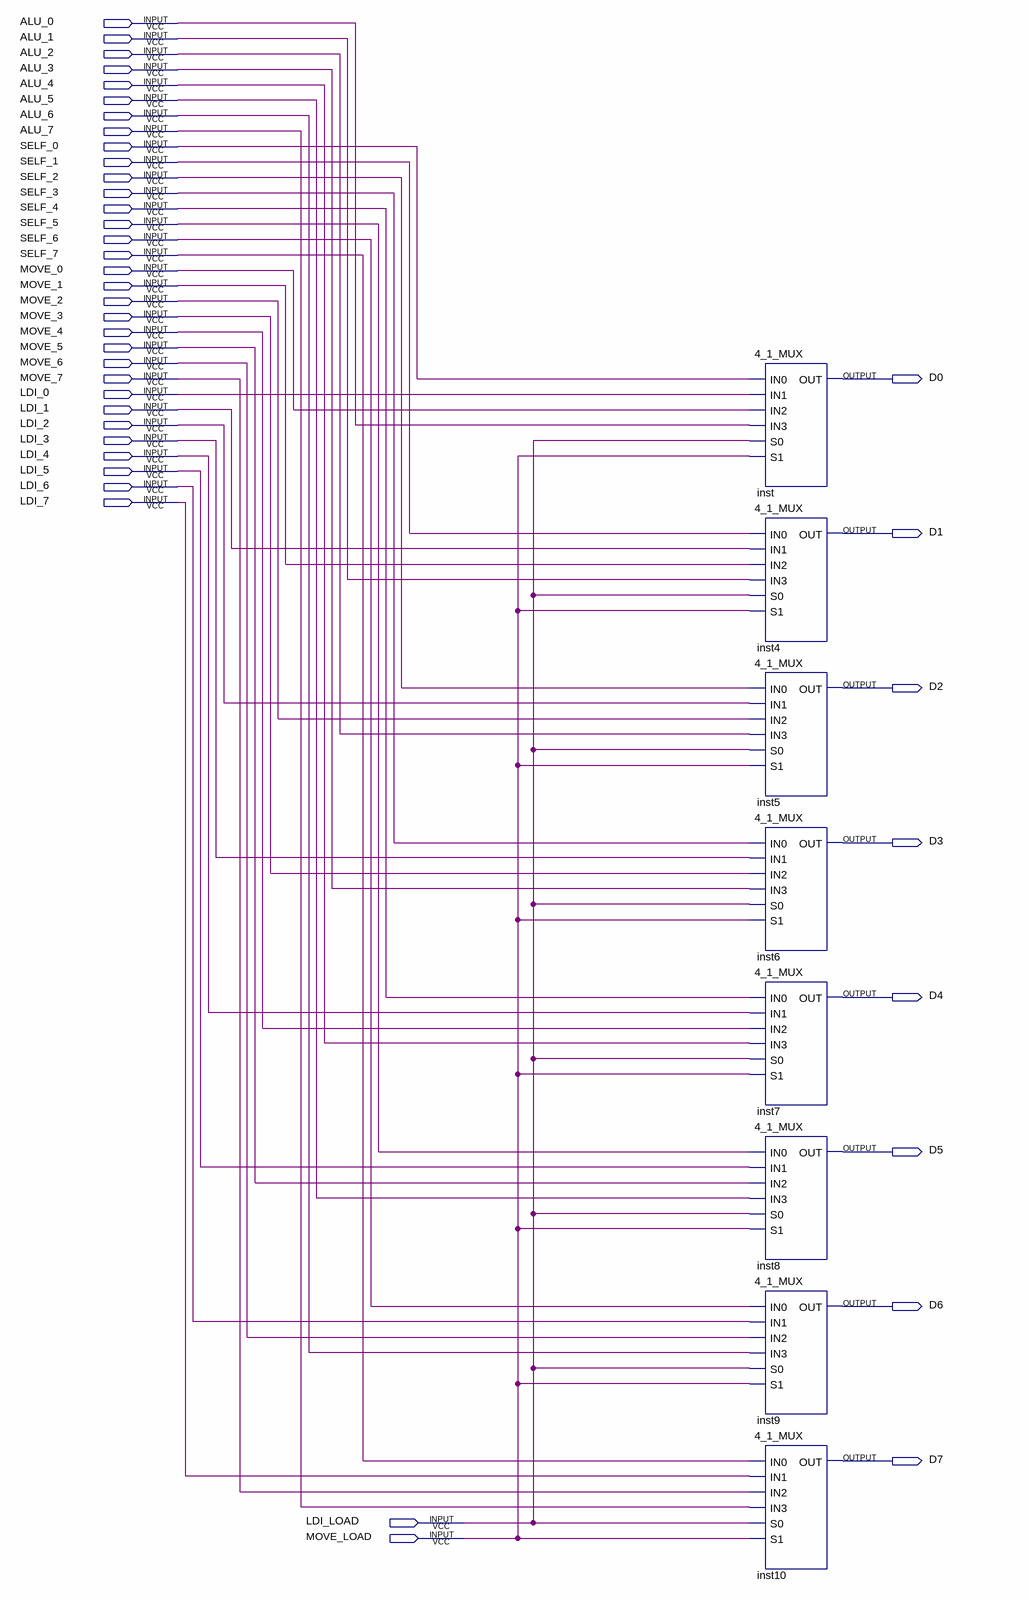
[diagram p0: schematic sheet]
// Quartus schematic DATA_LOAD_MUX.bdf as structural Verilog: 8 symbols, 42 pins
module DATA_LOAD_MUX (
  input  ALU_0,
  input  ALU_1,
  input  ALU_2,
  input  ALU_3,
  input  ALU_4,
  input  ALU_5,
  input  ALU_6,
  input  ALU_7,
  input  SELF_0,
  input  SELF_1,
  input  SELF_2,
  input  SELF_3,
  input  SELF_4,
  input  SELF_5,
  input  SELF_6,
  input  SELF_7,
  input  MOVE_0,
  input  MOVE_1,
  input  MOVE_2,
  input  MOVE_3,
  input  MOVE_4,
  input  MOVE_5,
  input  MOVE_6,
  input  MOVE_7,
  input  LDI_0,
  input  LDI_1,
  input  LDI_2,
  input  LDI_3,
  input  LDI_4,
  input  LDI_5,
  input  LDI_6,
  input  LDI_7,
  input  LDI_LOAD,
  input  MOVE_LOAD,
  output D0,
  output D1,
  output D2,
  output D3,
  output D4,
  output D5,
  output D6,
  output D7
);

  \4_1_MUX  inst (.IN0(SELF_0), .IN1(LDI_0), .IN2(MOVE_0), .IN3(ALU_0), .S0(LDI_LOAD), .S1(MOVE_LOAD), .OUT(D0));
  \4_1_MUX  inst4 (.IN0(SELF_1), .IN1(LDI_1), .IN2(MOVE_1), .IN3(ALU_1), .S0(LDI_LOAD), .S1(MOVE_LOAD), .OUT(D1));
  \4_1_MUX  inst5 (.IN0(SELF_2), .IN1(LDI_2), .IN2(MOVE_2), .IN3(ALU_2), .S0(LDI_LOAD), .S1(MOVE_LOAD), .OUT(D2));
  \4_1_MUX  inst6 (.IN0(SELF_3), .IN1(LDI_3), .IN2(MOVE_3), .IN3(ALU_3), .S0(LDI_LOAD), .S1(MOVE_LOAD), .OUT(D3));
  \4_1_MUX  inst7 (.IN0(SELF_4), .IN1(LDI_4), .IN2(MOVE_4), .IN3(ALU_4), .S0(LDI_LOAD), .S1(MOVE_LOAD), .OUT(D4));
  \4_1_MUX  inst8 (.IN0(SELF_5), .IN1(LDI_5), .IN2(MOVE_5), .IN3(ALU_5), .S0(LDI_LOAD), .S1(MOVE_LOAD), .OUT(D5));
  \4_1_MUX  inst9 (.IN0(SELF_6), .IN1(LDI_6), .IN2(MOVE_6), .IN3(ALU_6), .S0(LDI_LOAD), .S1(MOVE_LOAD), .OUT(D6));
  \4_1_MUX  inst10 (.IN0(SELF_7), .IN1(LDI_7), .IN2(MOVE_7), .IN3(ALU_7), .S0(LDI_LOAD), .S1(MOVE_LOAD), .OUT(D7));
endmodule
